# Altium schematic sheet Sheet2.SchDoc
size B
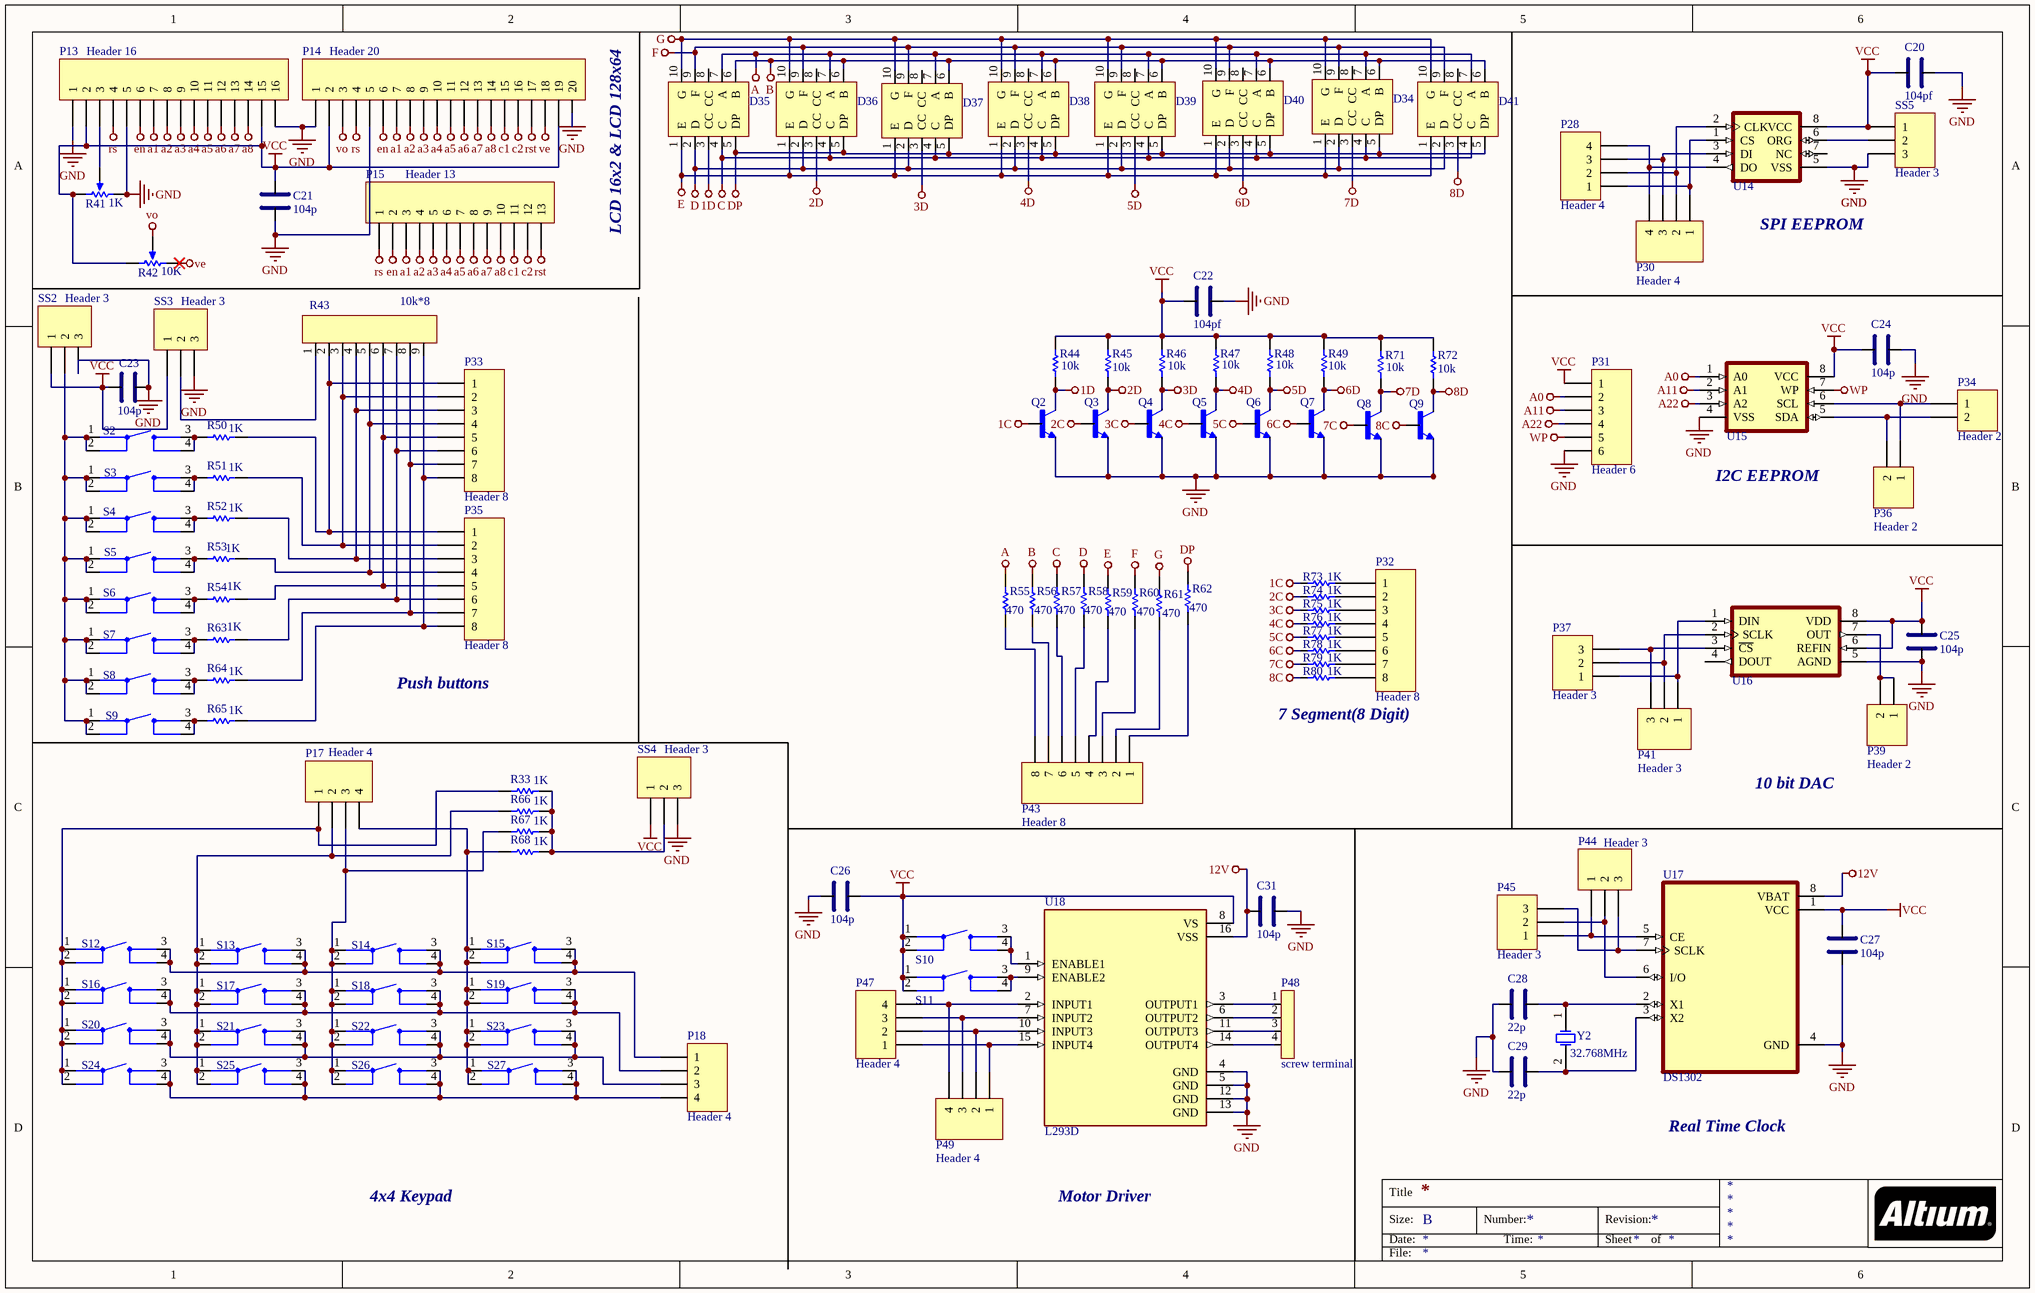
[diagram p0: Sheet2.SchDoc]

## Parts
C20  value 104pf  [cap]  (hidden comment: cap)
C21  value 104p  [cap]  (hidden comment: cap)
C22  value 104pf  [cap]  (hidden comment: cap)
C23  value 104p  [cap]  (hidden comment: cap)
C24  value 104p  [cap]  (hidden comment: cap)
C25  value 104p  [cap]  (hidden comment: cap)
C26  value 104p  [cap]  (hidden comment: cap)
C27  value 104p  [cap]  (hidden comment: cap)
C28  value 22p  [cap]  (hidden comment: cap)
C29  value 22p  [cap]  (hidden comment: cap)
C31  value 104p  [cap]  (hidden comment: cap)
D34  7seg  [LED_LTD-4708G]  (value not drawn)
D35  7seg  [LED_LTD-4708G]  (value not drawn)
D36  7seg  [LED_LTD-4708G]  (value not drawn)
D37  7seg  [LED_LTD-4708G]  (value not drawn)
D38  7seg  [LED_LTD-4708G]  (value not drawn)
D39  7seg  [LED_LTD-4708G]  (value not drawn)
D40  7seg  [LED_LTD-4708G]  (value not drawn)
D41  7seg  [LED_LTD-4708G]  (value not drawn)
P13  Header 16  [HDR1X16]
P14  Header 20  [HDR1X20]
P15  Header 13  [HDR1X13]
P17  Header 4  [HDR1X4]
P18  Header 4  [HDR1X4]
P28  Header 4  [HDR1X4]
P30  Header 4  [HDR1X4]
P31  Header 6  [HDR1X6]
P32  Header 8  [HDR1X8]
P33  Header 8  [HDR1X8]
P34  Header 2  [HDR1X2]
P35  Header 8  [HDR1X8]
P36  Header 2  [HDR1X2]
P37  Header 3  [HDR1X3]
P39  Header 2  [HDR1X2]
P41  Header 3  [HDR1X3]
P43  Header 8  [HDR1X8]
P44  Header 3  [HDR1X3]
P45  Header 3  [HDR1X3]
P47  Header 4  [HDR1X4]
P48  screw terminal  [screw library]
P49  Header 4  [HDR1X4]
Q2  2N5172  [TRANSISTOR_TO-92]  (value not drawn)
Q3  2N5172  [TRANSISTOR_TO-92]  (value not drawn)
Q4  2N5172  [TRANSISTOR_TO-92]  (value not drawn)
Q5  2N5172  [TRANSISTOR_TO-92]  (value not drawn)
Q6  2N5172  [TRANSISTOR_TO-92]  (value not drawn)
Q7  2N5172  [TRANSISTOR_TO-92]  (value not drawn)
Q8  2N5172  [TRANSISTOR_TO-92]  (value not drawn)
Q9  2N5172  [TRANSISTOR_TO-92]  (value not drawn)
R33  value 1K  [AXIAL-0.3]  (hidden comment: Res1)
R41  value 1K  [VR5]  (hidden comment: RPot)
R42  value 10K  [VR5]  (hidden comment: RPot)
R43  value 10k*8  [10k sip]  (hidden comment: 10k sip)
R44  value 10k  [AXIAL-0.3]  (hidden comment: Res1)
R45  value 10k  [AXIAL-0.3]  (hidden comment: Res1)
R46  value 10k  [AXIAL-0.3]  (hidden comment: Res1)
R47  value 10k  [AXIAL-0.3]  (hidden comment: Res1)
R48  value 10k  [AXIAL-0.3]  (hidden comment: Res1)
R49  value 10k  [AXIAL-0.3]  (hidden comment: Res1)
R50  value 1K  [AXIAL-0.3]  (hidden comment: Res1)
R51  value 1K  [AXIAL-0.3]  (hidden comment: Res1)
R52  value 1K  [AXIAL-0.3]  (hidden comment: Res1)
R53  value 1K  [AXIAL-0.3]  (hidden comment: Res1)
R54  value 1K  [AXIAL-0.3]  (hidden comment: Res1)
R55  value 470  [AXIAL-0.3]  (hidden comment: Res1)
R56  value 470  [AXIAL-0.3]  (hidden comment: Res1)
R57  value 470  [AXIAL-0.3]  (hidden comment: Res1)
R58  value 470  [AXIAL-0.3]  (hidden comment: Res1)
R59  value 470  [AXIAL-0.3]  (hidden comment: Res1)
R60  value 470  [AXIAL-0.3]  (hidden comment: Res1)
R61  value 470  [AXIAL-0.3]  (hidden comment: Res1)
R62  value 470  [AXIAL-0.3]  (hidden comment: Res1)
R63  value 1K  [AXIAL-0.3]  (hidden comment: Res1)
R64  value 1K  [AXIAL-0.3]  (hidden comment: Res1)
R65  value 1K  [AXIAL-0.3]  (hidden comment: Res1)
R66  value 1K  [AXIAL-0.3]  (hidden comment: Res1)
R67  value 1K  [AXIAL-0.3]  (hidden comment: Res1)
R68  value 1K  [AXIAL-0.3]  (hidden comment: Res1)
R71  value 10k  [AXIAL-0.3]  (hidden comment: Res1)
R72  value 10k  [AXIAL-0.3]  (hidden comment: Res1)
R73  value 1K  [AXIAL-0.3]  (hidden comment: Res1)
R74  value 1K  [AXIAL-0.3]  (hidden comment: Res1)
R75  value 1K  [AXIAL-0.3]  (hidden comment: Res1)
R76  value 1K  [AXIAL-0.3]  (hidden comment: Res1)
R77  value 1K  [AXIAL-0.3]  (hidden comment: Res1)
R78  value 1K  [AXIAL-0.3]  (hidden comment: Res1)
R79  value 1K  [AXIAL-0.3]  (hidden comment: Res1)
R80  value 1K  [AXIAL-0.3]  (hidden comment: Res1)
S2  SKHHANA010  [buttons]  (value not drawn)
S3  SKHHANA010  [buttons]  (value not drawn)
S4  SKHHANA010  [buttons]  (value not drawn)
S5  SKHHANA010  [buttons]  (value not drawn)
S6  SKHHANA010  [buttons]  (value not drawn)
S7  SKHHANA010  [buttons]  (value not drawn)
S8  SKHHANA010  [buttons]  (value not drawn)
S9  SKHHANA010  [buttons]  (value not drawn)
S10  SKHHANA010  [buttons]  (value not drawn)
S11  SKHHANA010  [buttons]  (value not drawn)
S12  SKHHANA010  [buttons]  (value not drawn)
S13  SKHHANA010  [buttons]  (value not drawn)
S14  SKHHANA010  [buttons]  (value not drawn)
S15  SKHHANA010  [buttons]  (value not drawn)
S16  SKHHANA010  [buttons]  (value not drawn)
S17  SKHHANA010  [buttons]  (value not drawn)
S18  SKHHANA010  [buttons]  (value not drawn)
S19  SKHHANA010  [buttons]  (value not drawn)
S20  SKHHANA010  [buttons]  (value not drawn)
S21  SKHHANA010  [buttons]  (value not drawn)
S22  SKHHANA010  [buttons]  (value not drawn)
S23  SKHHANA010  [buttons]  (value not drawn)
S24  SKHHANA010  [buttons]  (value not drawn)
S25  SKHHANA010  [buttons]  (value not drawn)
S26  SKHHANA010  [buttons]  (value not drawn)
S27  SKHHANA010  [buttons]  (value not drawn)
SS2  Header 3  [HDR1X3]
SS3  Header 3  [HDR1X3]
SS4  Header 3  [HDR1X3]
SS5  Header 3  [HDR1X3]
U14  93LC46A/P  [PIC10F220]  (value not drawn)
U15  24AA1025  [PIC10F220]  (value not drawn)
U16  TLC5615  [PIC10F220]  (value not drawn)
U17  DS1302  [PIC10F220]
U18  L293D  [L293D]
Y2  value 32.768MHz  [R38]  (hidden comment: XTAL)

## Nets
1C: Q2.2(B) R73.1
1D: D35.3(CC) Q2.1(C) R44.1
2C: Q3.2(B) R74.1
2D: D36.3(CC) Q3.1(C) R45.1
3C: Q4.2(B) R75.1
3D: D37.3(CC) Q4.1(C) R46.1
4C: Q5.2(B) R76.1
4D: D38.3(CC) Q5.1(C) R47.1
5C: Q6.2(B) R77.1
5D: D39.3(CC) Q6.1(C) R48.1
6C: Q7.2(B) R78.1
6D: D40.3(CC) Q7.1(C) R49.1
7C: Q8.2(B) R79.1
7D: D34.3(CC) Q8.1(C) R71.1
8C: Q9.2(B) R80.1
8D: D41.3(CC) Q9.1(C) R72.1
12V: C31.2 U17.8(VBAT) U18.16(VSS)
A: D34.7(A) D35.7(A) D36.7(A) D37.7(A) D38.7(A) D39.7(A) D40.7(A) D41.7(A) R55.2
A0: P31.2 U15.1(A0)
a1: P13.7 P14.7 P15.3
a2: P13.8 P14.8 P15.4
a3: P13.9 P14.9 P15.5
a4: P13.10 P14.10 P15.6
a5: P13.11 P14.11 P15.7
a6: P13.12 P14.12 P15.8
a7: P13.13 P14.13 P15.9
a8: P13.14 P14.14 P15.10
A11: P31.3 U15.2(A1)
A22: P31.4 U15.3(A2)
B: D34.6(B) D35.6(B) D36.6(B) D37.6(B) D38.6(B) D39.6(B) D40.6(B) D41.6(B) R56.2
C: D34.4(C) D35.4(C) D36.4(C) D37.4(C) D38.4(C) D39.4(C) D40.4(C) D41.4(C) R57.2
c1: P14.15 P15.11
c2: P14.16 P15.12
D: D34.2(D) D35.2(D) D36.2(D) D37.2(D) D38.2(D) D39.2(D) D40.2(D) D41.2(D) R58.2
DP: D34.5(DP) D35.5(DP) D36.5(DP) D37.5(DP) D38.5(DP) D39.5(DP) D40.5(DP) D41.5(DP) R62.2
E: D34.1(E) D35.1(E) D36.1(E) D37.1(E) D38.1(E) D39.1(E) D40.1(E) D41.1(E) R59.2
en: P13.6 P14.6 P15.2
F: D34.9(F) D35.9(F) D36.9(F) D37.9(F) D38.9(F) D39.9(F) D40.9(F) D41.9(F) R60.2
G: D34.10(G) D35.10(G) D36.10(G) D37.10(G) D38.10(G) D39.10(G) D40.10(G) D41.10(G) R61.2
GND: C20.1 C21.1 C22.1 C23.1 C24.1 C25.1 C26.2 C27.1 C28.2 C29.2 C31.1 P13.1 P13.5 P13.16 P14.1 P14.5 P14.20 P31.6 Q2.3(E) Q3.3(E) Q4.3(E) Q5.3(E) Q6.3(E) Q7.3(E) Q8.3(E) Q9.3(E) R41.1(TOP) SS2.3 SS3.3 SS4.3 SS5.3 U14.5(VSS) U15.4(VSS) U16.5(AGND) U17.4(GND) U18.4(GND) U18.5(GND) U18.12(GND) U18.13(GND)
rs: P13.4 P14.4 P15.1
rst: P14.17 P15.13
VCC: C20.2 C21.2 C22.2 C23.2 C24.2 C25.2 C26.1 C27.2 P13.2 P13.15 P14.2 P14.19 P31.1 R41.2(BOT) R42.2(BOT) R44.2 R45.2 R46.2 R47.2 R48.2 R49.2 R71.2 R72.2 S10.1 S10.2 S11.1 S11.2 SS2.1 SS3.1 SS4.1 SS5.1 U14.8(VCC) U15.8(VCC) U16.6(REFIN) U16.8(VDD) U17.1(VCC) U18.8(VS)
ve: P14.18 R42.1(TOP)
vo: P14.3 R42.3(TAP)
WP: P31.5 U15.7(WP)
NetC28_1: C28.1 U17.2(X1) Y2.1(OSC1)
NetC29_1: C29.1 U17.3(X2) Y2.2(OSC2)
NetP13_3: P13.3 R41.3(TAP)
NetP17_1: P17.1 R33.1 S12.1 S12.2 S16.1 S16.2 S20.1 S20.2 S24.1 S24.2
NetP17_2: P17.2 R66.1 S13.1 S13.2 S17.1 S17.2 S21.1 S21.2 S25.1 S25.2
NetP17_3: P17.3 R67.1 S14.1 S14.2 S18.1 S18.2 S22.1 S22.2 S26.1 S26.2
NetP17_4: P17.4 R68.1 S15.1 S15.2 S19.1 S19.2 S23.1 S23.2 S27.1 S27.2
NetP18_1: P18.1 S12.3 S12.4 S13.3 S13.4 S14.3 S14.4 S15.3 S15.4
NetP18_2: P18.2 S16.3 S16.4 S17.3 S17.4 S18.3 S18.4 S19.3 S19.4
NetP18_3: P18.3 S20.3 S20.4 S21.3 S21.4 S22.3 S22.4 S23.3 S23.4
NetP18_4: P18.4 S24.3 S24.4 S25.3 S25.4 S26.3 S26.4 S27.3 S27.4
NetP28_1: P28.1 P30.1 U14.1(CS)
NetP28_2: P28.2 P30.2 U14.2(CLK)
NetP28_3: P28.3 P30.3 U14.3(DI)
NetP28_4: P28.4 P30.4 U14.4(DO)
NetP32_1: P32.1 R73.2
NetP32_2: P32.2 R74.2
NetP32_3: P32.3 R75.2
NetP32_4: P32.4 R76.2
NetP32_5: P32.5 R77.2
NetP32_6: P32.6 R78.2
NetP32_7: P32.7 R79.2
NetP32_8: P32.8 R80.2
NetP33_1: P33.1 P35.1 R43.2 R50.2
NetP33_2: P33.2 P35.2 R43.3 R51.2
NetP33_3: P33.3 P35.3 R43.4 R52.2
NetP33_4: P33.4 P35.4 R43.5 R53.2
NetP33_5: P33.5 P35.5 R43.6 R54.2
NetP33_6: P33.6 P35.6 R43.7 R63.2
NetP33_7: P33.7 P35.7 R43.8 R64.2
NetP33_8: P33.8 P35.8 R43.9 R65.2
NetP34_1: P34.1 P36.1 U15.6(SCL)
NetP34_2: P34.2 P36.2 U15.5(SDA)
NetP37_1: P37.1 P41.1 U16.1(DIN)
NetP37_2: P37.2 P41.2 U16.2(SCLK)
NetP37_3: P37.3 P41.3 U16.3(~{CS})
NetP39_1: P39.1 P39.2 U16.7(OUT)
NetP43_1: P43.1 R62.1
NetP43_2: P43.2 R61.1
NetP43_3: P43.3 R60.1
NetP43_4: P43.4 R59.1
NetP43_5: P43.5 R58.1
NetP43_6: P43.6 R57.1
NetP43_7: P43.7 R56.1
NetP43_8: P43.8 R55.1
NetP44_1: P44.1 P45.1 U17.5(CE)
NetP44_2: P44.2 P45.2 U17.6(I/O)
NetP44_3: P44.3 P45.3 U17.7(SCLK)
NetP47_1: P47.1 P49.1 U18.15(INPUT4)
NetP47_2: P47.2 P49.2 U18.10(INPUT3)
NetP47_3: P47.3 P49.3 U18.7(INPUT2)
NetP47_4: P47.4 P49.4 U18.2(INPUT1)
NetP48_1: P48.1 U18.3(OUTPUT1)
NetP48_2: P48.2 U18.6(OUTPUT2)
NetP48_3: P48.3 U18.11(OUTPUT3)
NetP48_4: P48.4 U18.14(OUTPUT4)
NetR33_2: R33.2 R66.2 R67.2 R68.2 SS4.2
NetR43_1: R43.1 SS3.2
NetR50_1: R50.1 S2.3 S2.4
NetR51_1: R51.1 S3.3 S3.4
NetR52_1: R52.1 S4.3 S4.4
NetR53_1: R53.1 S5.3 S5.4
NetR54_1: R54.1 S6.3 S6.4
NetR63_1: R63.1 S7.3 S7.4
NetR64_1: R64.1 S8.3 S8.4
NetR65_1: R65.1 S9.3 S9.4
NetS2_1: S2.1 S2.2 S3.1 S3.2 S4.1 S4.2 S5.1 S5.2 S6.1 S6.2 S7.1 S7.2 S8.1 S8.2 S9.1 S9.2 SS2.2
NetS10_3: S10.3 S10.4 U18.1(ENABLE1)
NetS11_3: S11.3 S11.4 U18.9(ENABLE2)
NetSS5_2: SS5.2 U14.6(ORG)

Not connected (* = marked no-connect by the designer): D34 8(CC); D35 8(CC); D36 8(CC); D37 8(CC); D38 8(CC); D39 8(CC); D40 8(CC); D41 8(CC); U14 7(NC); U16 4(DOUT)

## Notes on the sheet
- LCD 16x2 & LCD 128x64
- SPI EEPROM
- (near U15) I2C EEPROM
- (near P35) Push buttons
- 7 Segment(8 Digit)
- 10 bit DAC
- Real Time Clock
- 4x4 Keypad
- Motor Driver
- Title
- Size:
- Date:
- B
- Number:
- Time:
- Revision:
- Sheet
- of
- File:

## Library data of the parts
P13 = Header 16: Header, 16-Pin; LatestRevisionDate: 17-Jul-2002; LatestRevisionNote: Re-released for DXP Platform.; Publisher: Altium Limited
P14 = Header 20: Header, 20-Pin; LatestRevisionDate: 17-Jul-2002; LatestRevisionNote: Re-released for DXP Platform.; Publisher: Altium Limited
P15 = Header 13: Header, 13-Pin; LatestRevisionDate: 17-Jul-2002; LatestRevisionNote: Re-released for DXP Platform.; Publisher: Altium Limited
P17 P18 P28 P30 P47 P49 = Header 4: Header, 4-Pin; LatestRevisionDate: 17-Jul-2002; LatestRevisionNote: Re-released for DXP Platform.; Publisher: Altium Limited
P31 = Header 6: Header, 6-Pin; LatestRevisionDate: 17-Jul-2002; LatestRevisionNote: Re-released for DXP Platform.; Publisher: Altium Limited
P32 P33 P35 P43 = Header 8: Header, 8-Pin; LatestRevisionDate: 17-Jul-2002; LatestRevisionNote: Re-released for DXP Platform.; Publisher: Altium Limited
P34 P36 P39 = Header 2: Header, 2-Pin; LatestRevisionDate: 17-Jul-2002; LatestRevisionNote: Re-released for DXP Platform.; Publisher: Altium Limited
P37 P41 P44 P45 SS2-SS5 = Header 3: Header, 3-Pin; LatestRevisionDate: 17-Jul-2002; LatestRevisionNote: Re-released for DXP Platform.; Publisher: Altium Limited
Q2-Q9 = 2N5172: Bipolar (BJT) Transistor NPN 25V 500mA 625mW Through Hole TO-92-3; MF: ON Semiconductor; Package: TO-92 ON Semiconductor; DigiKey-Purchase-URL: https://snapeda.com/shop?store=DigiKey&id=2663226; Value: *; Availability: Warning; SnapEDA_Link: https://www.snapeda.com/parts/2N5172/ON%20Semiconductor/view-part/2663226/?ref=snap; Price: None; MP: 2N5172
R33 R44-R68 R71-R80 = Res1: Resistor; Published: 8-Jun-2000; LatestRevisionDate: 17-Jul-2002; LatestRevisionNote: Re-released for DXP Platform.; PackageReference: AXIAL-0.3; Publisher: Altium Limited
  R33 R44-R54 R56-R67 R71-R80: PackageDescription: Axial Device, Thru-Hole; 2 Leads; 0.3 in Pin Spacing
  R55: PackageDescription: TH.HOLE
  R68: PackageDescription: Axial Device, Thru-Hole; 2 Leads; 0.3 in Pin Spacing; PACKAGE: TH.HOLE
R41 R42 = RPot: Potentiometer; Sim Note: Enter the Resistance value and the set point into parameter fields.; Set Position: 0.5; Published: 8-Jun-2000; LatestRevisionDate: 17-Jul-2002; LatestRevisionNote: Re-released for DXP Platform.; PackageReference: VR5; Publisher: Altium Limited; PackageDescription: Variable Resistor, Thru-Hole; 3 Leads
S2-S27 = SKHHANA010: Switch Tactile N.O. SPST Round Button PC Pins 0.05A 12VDC 0.98N Thru-Hole Bulk; MF: ALPS; Value: *; SnapEDA_Link: https://www.snapeda.com/parts/SKHHANA010/ALPS/view-part/248805/?ref=snap; Price: None; Availability: Unavailable; Package: None; MP: SKHHANA010
U14 = 93LC46A/P: EEPROM Memory IC 1Kb (128 x 8) SPI 2MHz 8-PDIP; MF: Microchip; Value: *; Check_prices: https://www.snapeda.com/parts/93LC46A/P/Microchip/view-part/184688/?ref=eda; Availability: Good; Price: None; MP: 93LC46A/P; Package: DIP-8 Microchip; Purchase-URL: https://pricing.snapeda.com/search/part/93LC46A/P/?ref=eda; SnapEDA_Link: https://www.snapeda.com/parts/93LC46A/P/Microchip/view-part/184688/?ref=snap
U15 = 24AA1025-I/P: EEPROM Memory IC 1Mb (128K x 8) IÂ²C 400kHz 900ns 8-PDIP; MF: Microchip; MP: 24AA1025-I/P; Purchase-URL: https://pricing.snapeda.com/search/part/24AA1025-I/P/?ref=eda; Price: None; SnapEDA_Link: https://www.snapeda.com/parts/24AA1025-I/P/Microchip/view-part/1178/?ref=snap; Package: DIP-8 Microchip; Availability: Warning; Check_prices: https://www.snapeda.com/parts/24AA1025-I/P/Microchip/view-part/1178/?ref=eda; Value: *
U16 = TLC5615CP: 10-bit, single-channel, low-power DAC with 12.5us settling time and power-on reset 8-PDIP 0 to 70; MF: Texas Instruments; MP: TLC5615CP; Purchase-URL: https://pricing.snapeda.com/search/part/TLC5615CP/?ref=eda; Price: None; SnapEDA_Link: https://www.snapeda.com/parts/TLC5615CP/Texas%20Instruments/view-part/480984/?ref=snap; Check_prices: https://www.snapeda.com/parts/TLC5615CP/Texas%20Instruments/view-part/480984/?ref=eda; Package: PDIP-8 Texas; Availability: Warning; Value: *
U17 = DS1302: Real Time Clock _RTC_ IC Clock/Calendar 31B 8-DIP _0.300, 7.62mm_; MP: DS1302+; MF: Maxim Integrated; Digi-Key_Part_Number: DS1302+-ND; Value: *; SnapEDA_Link: https://www.snapeda.com/parts/DS1302%2B/Maxim%20Integrated/view-part/211653/?ref=snap; Digi-Key_Purchase_URL: https://www.digikey.co.id/product-detail/en/maxim-integrated/DS1302-/DS1302--ND/956878?utm_source=snapeda&utm_medium=aggregator&utm_campaign=symbol; Package: PDIP-8 Maxim
Y2 = XTAL: Crystal Oscillator; Published: 8-Jun-2000; LatestRevisionDate: 17-Jul-2002; LatestRevisionNote: Re-released for DXP Platform.; PackageReference: R38; Publisher: Altium Limited; PackageDescription: Crystal, Thru-Hole; 2 Leads; Body 3.1 x 8.2 mm (Dia.xH)